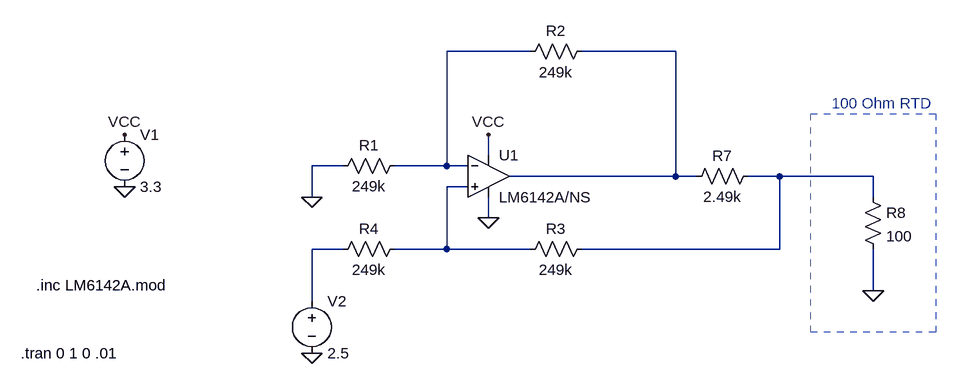
[diagram p0: schematic Flight_Current_Source.asc]
Flight_Current_Source.asc, the LTspice schematic file:
Version 4
SHEET 1 1284 680
WIRE 640 48 512 48
WIRE 864 48 720 48
WIRE 576 208 576 176
WIRE 352 224 304 224
WIRE 512 224 512 48
WIRE 512 224 432 224
WIRE 544 224 512 224
WIRE 864 240 864 48
WIRE 864 240 608 240
WIRE 896 240 864 240
WIRE 1024 240 976 240
WIRE 1168 240 1024 240
WIRE 544 256 512 256
WIRE 304 272 304 224
WIRE 1168 272 1168 240
WIRE 576 304 576 272
WIRE 352 352 304 352
WIRE 512 352 512 256
WIRE 512 352 432 352
WIRE 640 352 512 352
WIRE 1024 352 1024 240
WIRE 1024 352 720 352
WIRE 1168 416 1168 352
WIRE 304 432 304 352
FLAG 16 256 0
FLAG 304 512 0
FLAG 304 272 0
FLAG 576 304 0
FLAG 16 176 VCC
FLAG 576 176 VCC
FLAG 1168 416 0
SYMBOL voltage 16 160 R0
WINDOW 123 0 0 Left 2
WINDOW 39 0 0 Left 2
SYMATTR InstName V1
SYMATTR Value 3.3
SYMBOL voltage 304 416 R0
WINDOW 123 0 0 Left 2
WINDOW 39 0 0 Left 2
SYMATTR InstName V2
SYMATTR Value 2.5
SYMBOL Opamps\\opamp2 576 176 R0
SYMATTR InstName U1
SYMATTR Value LM6142A/NS
SYMBOL res 448 208 R90
WINDOW 0 0 56 VBottom 2
WINDOW 3 32 56 VTop 2
SYMATTR InstName R1
SYMATTR Value 249k
SYMBOL res 448 336 R90
WINDOW 0 0 56 VBottom 2
WINDOW 3 32 56 VTop 2
SYMATTR InstName R4
SYMATTR Value 249k
SYMBOL res 736 336 R90
WINDOW 0 0 56 VBottom 2
WINDOW 3 32 56 VTop 2
SYMATTR InstName R3
SYMATTR Value 249k
SYMBOL res 736 32 R90
WINDOW 0 0 56 VBottom 2
WINDOW 3 32 56 VTop 2
SYMATTR InstName R2
SYMATTR Value 249k
SYMBOL res 992 224 R90
WINDOW 0 0 56 VBottom 2
WINDOW 3 32 56 VTop 2
SYMATTR InstName R7
SYMATTR Value 2.49k
SYMBOL res 1152 256 R0
SYMATTR InstName R8
SYMATTR Value 100
TEXT -120 408 Left 2 !.inc LM6142A.mod
TEXT -144 512 Left 2 !.tran 0 1 0 .01
TEXT 1104 128 Left 2 ;100 Ohm RTD
RECTANGLE Normal 1264 480 1072 144 2

The netlist it stands for:
* Flight_Current_Source.asc
V1 VCC 0 3.3
V2 N005 0 2.5
XU1 N004 N001 VCC 0 N002 LM6142A/NS  ; pins In+ In- V+ V- OUT
R1 N001 0 249k
R4 N004 N005 249k
R3 N003 N004 249k
R2 N002 N001 249k
R7 N003 N002 2.49k
R8 N003 0 100
.inc LM6142A.mod
.tran 0 1 0 .01
* 100 Ohm RTD
.backanno
.end